# EAGLE design Harmonic Controller (EAGLE 9.6.2)
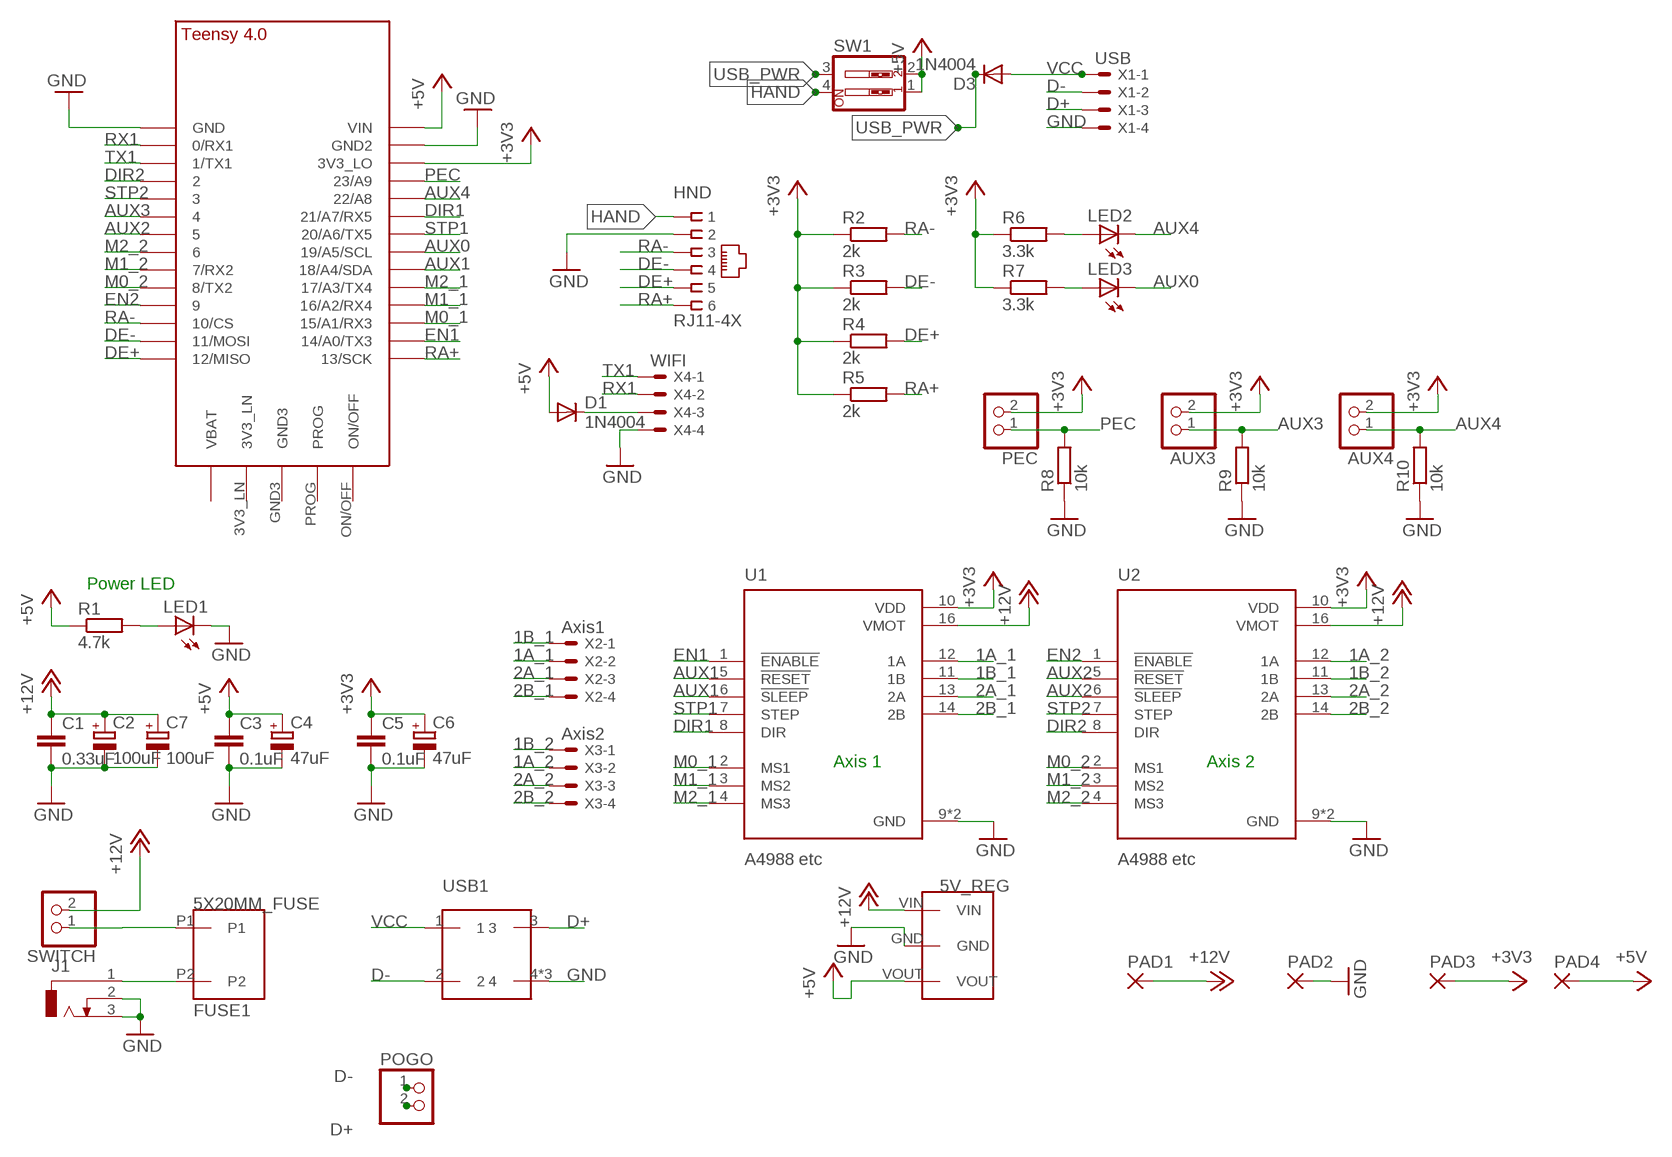
[diagram p0: schematic, sheet 1]

## Parts
5V_REG  TSR_5V  [TSR_5V]
AUX3  PINHD-1X2  [1X02]
AUX4  PINHD-1X2  [1X02]
C1  0.33uF  C-EU050-024X044  [C050-024X044]
C2  100uF  CPOL-EUE5-8.5  [E5-8,5]
C3  0.1uF  C-EU050-024X044  [C050-024X044]
C4  47uF  CPOL-EUE5-8.5  [E5-8,5]
C5  0.1uF  C-EU050-024X044  [C050-024X044]
C6  47uF  CPOL-EUE5-8.5  [E5-8,5]
C7  100uF  CPOL-EUE5-8.5  [E5-8,5]
D1  1N4004  [DO41-10]
D3  1N4004  [DO41-10]
FUSE1  5X20MM_FUSE  [5X20MM_FUSE]
HND  RJ11-4X  [RJ11-NO_SHIELD]
J1  DCJ0303  [DCJ0303]
LED1  LED5MM  [LED5MM]
LED2  LED5MM  [LED5MM]
LED3  LED5MM  [LED5MM]
PAD1  SMD2  [SMD1,27-2,54]
PAD2  SMD2  [SMD1,27-2,54]
PAD3  SMD2  [SMD1,27-2,54]
PAD4  SMD2  [SMD1,27-2,54]
PEC  PINHD-1X2  [1X02]
POGO  PINHD-1X2  [1X02]
R1  4.7k  R-EU_0207/7  [0207/7]
R2  2k  R-EU_0207/7  [0207/7]
R3  2k  R-EU_0207/7  [0207/7]
R4  2k  R-EU_0207/7  [0207/7]
R5  2k  R-EU_0207/7  [0207/7]
R6  3.3k  R-EU_0207/7  [0207/7]
R7  3.3k  R-EU_0207/7  [0207/7]
R8  10k  R-EU_0207/7  [0207/7]
R9  10k  R-EU_0207/7  [0207/7]
R10  10k  R-EU_0207/7  [0207/7]
SW1  SW_DIP-2  [EDG-02]
SWITCH  PINHD-1X2  [1X02]
U1  A4988 etc  A4988_STEPPER_MOTOR_DRIVER_CARRIER  [MODULE_A4988_STEPPER_MOTOR_DRIVER_CARRIER]
U2  A4988 etc  A4988_STEPPER_MOTOR_DRIVER_CARRIER  [MODULE_A4988_STEPPER_MOTOR_DRIVER_CARRIER]
U$1  TEENSY_4.0  [TEENSY_4.0]
USB1  USB-B_SOCKET  [USB-B_SOCKET]
X1  USB  JST-XH-04-PIN-ROUND-PAD  [JST-XH-04-PACKAGE-ROUND-PAD]
X2  Axis1  JST-XH-04-PIN-LONG-PAD  [JST-XH-04-PACKAGE-LONG-PAD]
X3  Axis2  JST-XH-04-PIN-LONG-PAD  [JST-XH-04-PACKAGE-LONG-PAD]
X4  WIFI  JST-XH-04-PIN-LONG-PAD  [JST-XH-04-PACKAGE-LONG-PAD]

## Nets
1A_1: U1.12(1A) X2.2
1A_2: U2.12(1A) X3.2
1B_1: U1.11(1B) X2.1
1B_2: U2.11(1B) X3.1
2A_1: U1.13(2A) X2.3
2A_2: U2.13(2A) X3.3
2B_1: U1.14(2B) X2.4
2B_2: U2.14(2B) X3.4
+3V3: AUX3.2 AUX4.2 C5.1 C6.+ PAD3.1(P) PEC.2 R2.1 R3.1 R4.1 R5.1 R6.1 R7.1 U1.10(VDD) U2.10(VDD) U$1.3V3_LO
+5V: 5V_REG.VOUT C3.1 C4.+ D1.A PAD4.1(P) R1.1 SW1.1 SW1.2 U$1.VIN
+12V: 5V_REG.VIN C1.1 C2.+ C7.+ PAD1.1(P) SWITCH.2 U1.16(VMOT) U2.16(VMOT)
AUX0: LED3.K(C) U$1.19/A5/SCL
AUX1: U1.5(!RESET) U1.6(!SLEEP) U$1.18/A4/SDA
AUX2: U2.5(!RESET) U2.6(!SLEEP) U$1.5
AUX3: AUX3.1 R9.2 U$1.4/CANRX
AUX4: AUX4.1 LED2.K(C) R10.2 U$1.22/A8
D+: POGO.2 USB1.3 X1.3
D-: POGO.1 USB1.2 X1.2
DE+: HND.5 R4.2 U$1.12/MISO
DE-: HND.4 R3.2 U$1.11/MOSI
DIR1: U1.8(DIR) U$1.21/A7(21/A7/RX5)
DIR2: U2.8(DIR) U$1.2
EN1: U1.1(!ENABLE) U$1.14/A0(14/A0/TX3)
EN2: U2.1(!ENABLE) U$1.9/CS
GND: 5V_REG.GND C1.2 C2.- C3.2 C4.- C5.2 C6.- C7.- HND.2 J1.2 J1.3 LED1.K(C) PAD2.1(P) R8.1 R9.1 R10.1 U1.9(GND) U1.15(GND) U2.9(GND) U2.15(GND) U$1.GND U$1.GND2 USB1.4 USB1.P$1 USB1.P$2 X1.4 X4.4
HAND: HND.1 SW1.4
M0_1: U1.2(MS1) U$1.15/A1(15/A1/RX3)
M0_2: U2.2(MS1) U$1.8(8/TX2)
M1_1: U1.3(MS2) U$1.16/A2(16/A2/RX4)
M1_2: U2.3(MS2) U$1.7(7/RX2)
M2_1: U1.4(MS3) U$1.17/A3(17/A3/TX4)
M2_2: U2.4(MS3) U$1.6
N$1: FUSE1.P2 J1.1
N$2: FUSE1.P1 SWITCH.1
N$3: LED1.A R1.2
N$4: D1.C X4.3
N$7: LED2.A R6.2
N$8: LED3.A R7.2
PEC: PEC.1 R8.2 U$1.23/A9
RA+: HND.6 R5.2 U$1.13/SCK
RA-: HND.3 R2.2 U$1.10/CS
RX1: U$1.0/RX(0/RX1) X4.2
STP1: U1.7(STEP) U$1.20/A6(20/A6/TX5)
STP2: U2.7(STEP) U$1.3/CANTX
TX1: U$1.1/TX(1/TX1) X4.1
USB_PWR: D3.C SW1.3
VCC: D3.A USB1.1 X1.1
Unconnected: U$1.3V3_LN U$1.GND3 U$1.ON/OFF U$1.PROG U$1.VBAT\(VBAT)

## Notes on the sheet
- Power LED
- Axis 1 | Axis 2

## Library data of the parts
5V_REG = alans_lbr:TSR_5V
AUX3 AUX4 PEC POGO SWITCH = pinhead:PINHD-1X2: PIN HEADER
C1 C3 C5 = rcl:C-EU: CAPACITOR, European symbol; SPICEPREFIX: C
C2 C4 C6 C7 = rcl:CPOL-EU: POLARIZED CAPACITOR, European symbol; SPICEPREFIX: C
D1 D3 = adafruit:1N4004: DIODE General purpose 1N400x type rectifier (With bigger pads) http://www.ladyada.net/library/pcb/eaglelibrary.html
FUSE1 = alans_lbr:5X20MM_FUSE
HND = con-tycoelectronics:RJ11: CORCOM Modular RJ Jacks No Shield Source: www.tycoelectronics.com .. ENG_DS_1654001_1099_RJ_L_0507.pdf; MPN: 6609214-3; OC_FARNELL: unknown; OC_NEWARK: 19R7022
J1 = con-jack:DCJ0303: DC POWER JACK Source: DCJ0303.pdf; OC_FARNELL: unknown; OC_NEWARK: unknown
LED1-LED3 = adafruit:LED: LED OSRAM: - CHIPLED LG R971, LG N971, LY N971, LG Q971, LY Q971, LO R971, LY R971 LH N974, LH R974 LS Q976, LO Q976, LY Q976 LO Q996 - Hyper CHIPLED LW Q18S LB Q993, LB Q99A, LB R99A - SideLED LS A670, LO A670, LY A670, LG A670, LP A670 LB A673, LV A673, LT A673, LW A673 LH A674 LY A675 LS A676, LA A676, LO A676, LY A676, LW A676 LS A679, LY A679, LG A679 - Hyper Micro SIDELED® LS Y876, LA Y876, LO Y876, LY Y876 LT Y87S - SmartLED LW L88C, LW L88S LB L89C, LB L89S, LG L890 LS L89K, LO L89K, LY L89K LS L896, LA L896, LO L896, LY L896 - TOPLED LS T670, LO T670, LY T670, LG T670, LP T670 LSG T670, LSP T670, LSY T670, LOP T670, LYG T670 LG T671, LOG T671, LSG T671 LB T673, LV T673, LT T673, LW T673 LH T674 LS T676, LA T676, LO T676, LY T676, LB T676, LH T676, LSB T676, LW T676 LB T67C, LV T67C, LT T67C, LS T67K, LO T67K, LY T67K, LW E67C LS E67B, LA E67B, LO E67B, LY E67B, LB E67C, LV E67C, LT E67C LW T67C LS T679, LY T679, LG T679 LS T770, LO T770, LY T770, LG T770, LP T770 LB T773, LV T773, LT T773, LW T773 LH T774 LS E675, LA E675, LY E675, LS T675 LS T776, LA T776, LO T776, LY T776, LB T776 LHGB T686 LT T68C, LB T68C - Hyper Mini TOPLED® LB M676 - Mini TOPLED Santana® LG M470 LS M47K, LO M47K, LY M47K Source: http://www.osram.convergy.de/
PAD1-PAD4 = wirepad:SMD2: SMD PAD
R1-R10 = rcl:R-EU_: RESISTOR, European symbol; SPICEPREFIX: R
SW1 = special:SW_DIP-2: DIP SWITCH
U1 U2 = A4988_STEPPER_MOTOR_DRIVER_CARRIER:A4988_STEPPER_MOTOR_DRIVER_CARRIER: Stepper motor controler; IC: A4988; 1A; Uin mot: 8÷35V Check availability <https://pricing.snapeda.com/parts/A4988%20STEPPER%20MOTOR%20DRIVER%20CARRIER/Pololu/view-part?ref=eda>; AVAILABILITY: Not in stock; DESCRIPTION: Stepper Motor Driver; MF: Pololu; MP: A4988 STEPPER MOTOR DRIVER CARRIER; PACKAGE: None; PRICE: None
U$1 = TEENSY 4.0:TEENSY_4.0
USB1 = alans_lbr:USB-B_SOCKET
X1-X4 = JST_XH_Connectors:JST-XH-04-PIN: JST XH Connector 2 Pin Wire to board connector. Pitch: 2,54 mm, (0.100") Number of pins: 4 Created by Rembrandt Electronics www.rembrandtelectronics.com

## Board
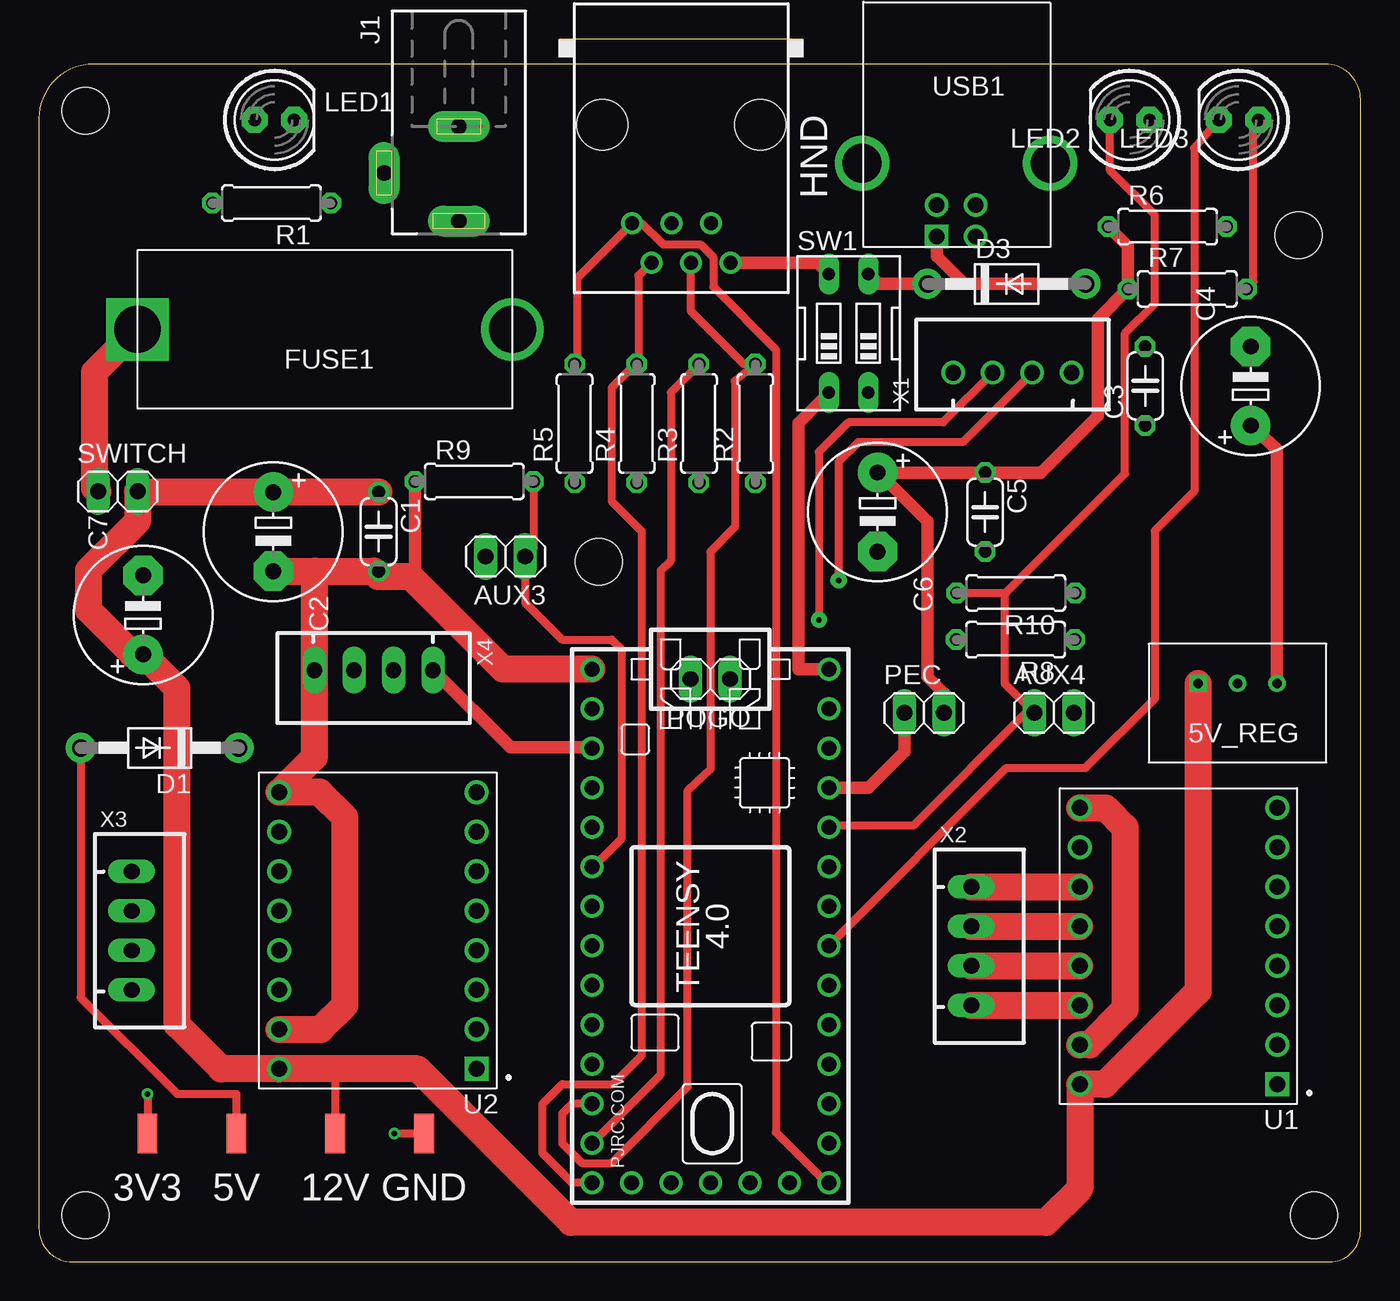
[diagram p1: board, top side]
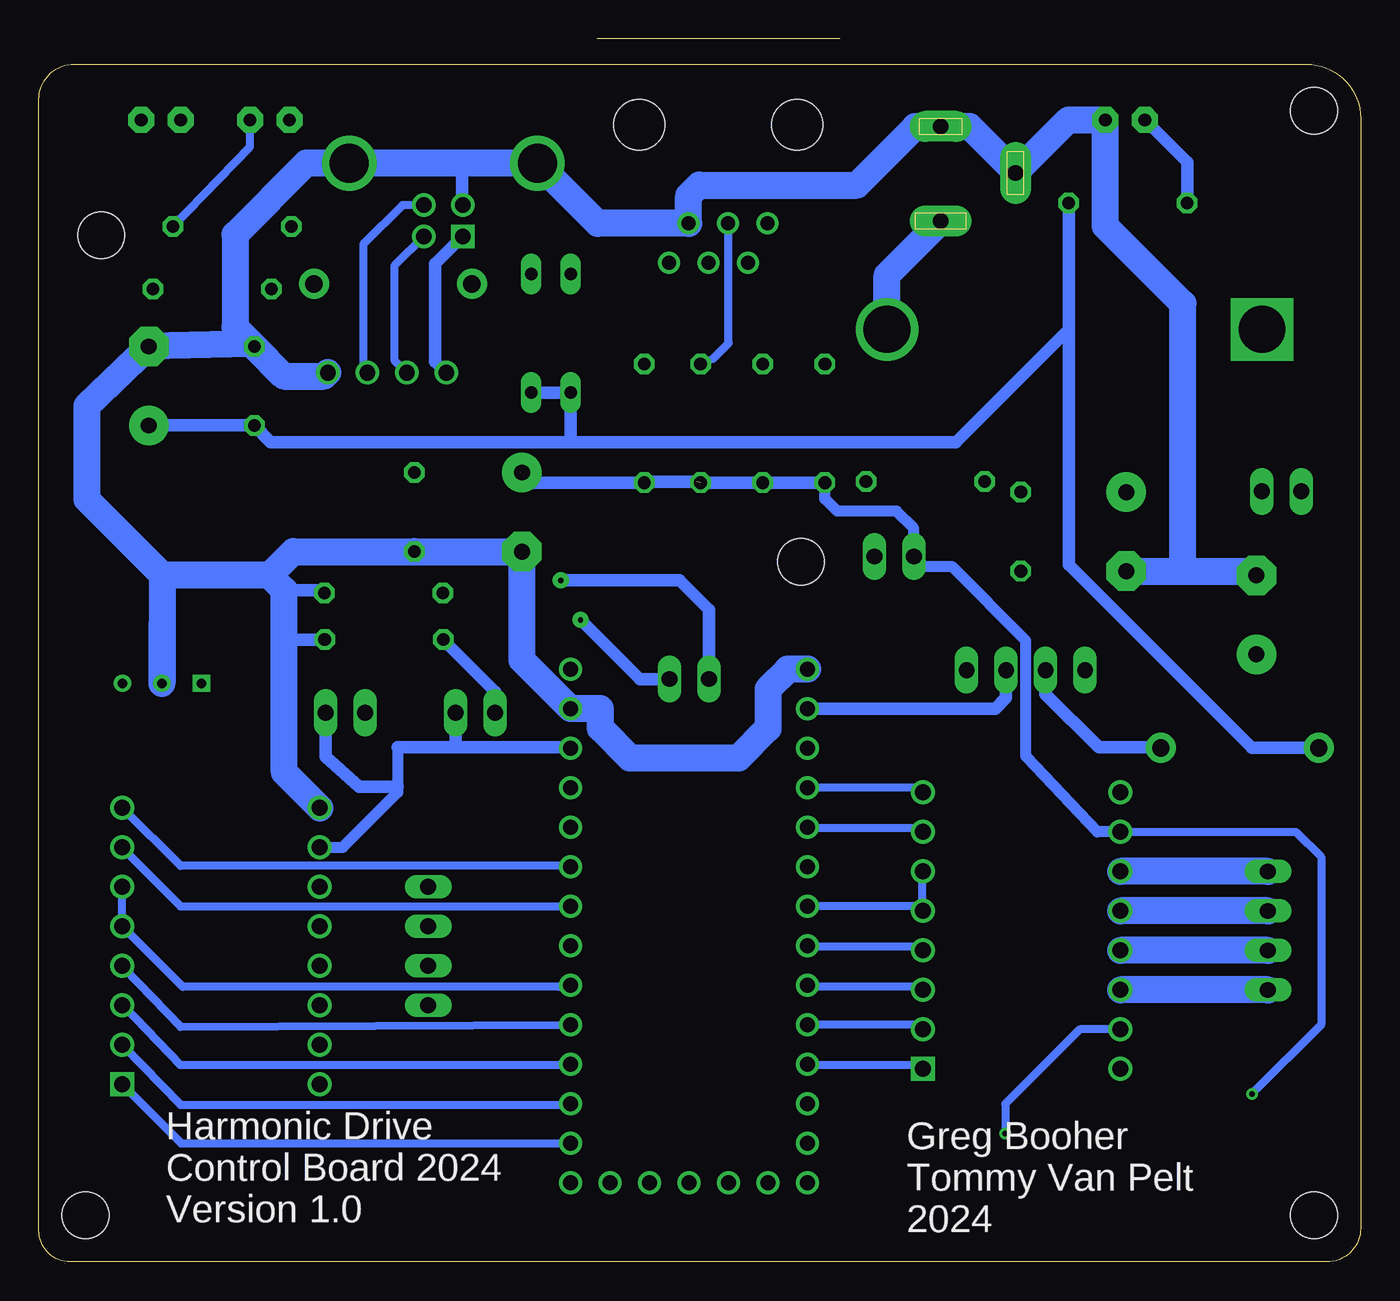
[diagram p2: board, bottom side, seen from below]

Size 85 x 77 mm. Coordinates in mm from the lower left corner, seen from the top.
Outline: 0,73.5 0,2.17 arc90 2.17,0 82.99,0 arc90 85,2.01 85,74.72 arc90 82.72,77 3.5,77 arc90 0,73.5
Copper layers (1*16): Top 0.035mm / dielectric 1.5mm / Bottom 0.035mm
Design rules "default": minimum track width 6mil, minimum drill 0.35mm, track to track 6mil, track to pad 6mil, pad to pad 6mil, via to via 6mil, smd to smd 6mil, copper to edge 40mil, drill to drill 6mil, minimum pad ring 10mil, minimum via ring 8mil, stop-mask expansion 4mil, vias tented up to drill 0mil, thermal gap 10mil
Holes 3 mm at 3,74 3,3 82,3 81,66 36,45

### Footprints (pad centres in the part's own frame; a part is rotated, then mirrored left to right if it is on the bottom)
TSR_5V = drill 0.6: GND 5.715,5.08; VOUT 8.255,5.08 | drill 0.6 square: VIN 3.175,5.08
1X02 = drill 1.016 long: 1 -1.27,0; 2 1.27,0
C050-024X044 = drill 0.813 octagon: 1 -2.54,0; 2 2.54,0
E5-8,5 = drill 1.016 pad 2.54: + -2.54,0 | drill 1.016 pad 2.54 octagon: - 2.54,0
DO41-10 = drill 1.118 pad 1.93: A 5.08,0; C -5.08,0
5X20MM_FUSE = drill 3 square: P1 5.08,24.13 | drill 3: P2 5.08,0
RJ11-NO_SHIELD = drill 0.9 pad 1.4: 1 -3.175,8.89; 2 -1.905,6.35; 3 -0.635,8.89; 4 0.635,6.35; 5 1.905,8.89; 6 3.175,6.35 | hole 3.251: -5.08,0; 5.08,0
DCJ0303 = drill 1 pad 2 long: 1 0,3.1; 2 4.8,0; 3 0,-3
LED5MM = drill 0.813 pad 1.676 octagon: A -1.27,0; K 1.27,0
SMD1,27-2,54 = smd 1.27 x 2.54: 1 0,0
0207/7 = drill 0.813 octagon: 1 -3.81,0; 2 3.81,0
EDG-02 = drill 0.813 long: 1 -1.27,-3.81; 2 1.27,-3.81; 3 1.27,3.81; 4 -1.27,3.81
MODULE_A4988_STEPPER_MOTOR_DRIVER_CARRIER = drill 1.02 square: 1 -6.35,8.89 | drill 1.02: 2 -6.35,6.35; 3 -6.35,3.81; 4 -6.35,1.27; 5 -6.35,-1.27; 6 -6.35,-3.81; 7 -6.35,-6.35; 8 -6.35,-8.89; 9 6.35,-8.89; 10 6.35,-6.35; 11 6.35,-3.81; 12 6.35,-1.27; 13 6.35,1.27; 14 6.35,3.81; 15 6.35,6.35; 16 6.35,8.89
TEENSY_4.0 = drill 0.965: 0/RX -13.97,-7.62; 1/TX -11.43,-7.62; 2 -8.89,-7.62; 3/CANTX -6.35,-7.62; 3V3_LN 16.51,-2.54; 3V3_LO -11.43,7.62; 4/CANRX -3.81,-7.62; 5 -1.27,-7.62; 6 1.27,-7.62; 7 3.81,-7.62; 8 6.35,-7.62; 9/CS 8.89,-7.62; 10/CS 11.43,-7.62; 11/MOSI 13.97,-7.62; 12/MISO 16.51,-7.62; 13/SCK 16.51,7.62; 14/A0 13.97,7.62; 15/A1 11.43,7.62; 16/A2 8.89,7.62; 17/A3 6.35,7.62; 18/A4/SDA 3.81,7.62; 19/A5/SCL 1.27,7.62; 20/A6 -1.27,7.62; 21/A7 -3.81,7.62; 22/A8 -6.35,7.62; 23/A9 -8.89,7.62; GND -16.51,-7.62; GND2 -13.97,7.62; GND3 16.51,0; ON/OFF 16.51,5.08; PROG 16.51,2.54; VBAT\ 16.51,-5.08; VIN -16.51,7.62
USB-B_SOCKET = drill 1 square: 1 7.3,4.7 | drill 1: 2 4.8,4.7; 3 4.8,2.7; 4 7.3,2.7 | drill 2.5: P$1 0,0; P$2 12.1,0
JST-XH-04-PACKAGE-ROUND-PAD = drill 1.016: 1 -3.81,0; 2 -1.27,0; 3 1.27,0; 4 3.81,0
JST-XH-04-PACKAGE-LONG-PAD = drill 1.016 long: 1 -3.81,0; 2 -1.27,0; 3 1.27,0; 4 3.81,0

### Placement (x,y rotation side)
5V_REG  71.36,32.11 0 top
AUX3  30,45.34 180 top
AUX4  65.28,35.3 0 top
C1  21.85,46.94 270 top
C2  15.07,46.94 270 top
C3  71.15,56.31 90 top
C4  77.93,56.31 90 top
C5  60.85,48.2 270 top
C6  53.93,48.2 270 top
C7  6.71,41.59 90 top
D1  7.77,33.04 180 top
D3  62.23,62.87 0 top
FUSE1  30.46,54.87 90 top
HND  41.31,73.11 180 top
J1  27,70 180 top
LED1  15.15,73.41 0 top
LED2  70.15,73.41 180 top
LED3  77.15,73.41 180 top
PAD1  19.05,8.26 0 top
PAD2  24.77,8.26 0 top
PAD3  6.99,8.26 0 top
PAD4  12.7,8.26 0 top
PEC  56.93,35.3 0 top
POGO  43.18,37.47 180 top
R1  14.96,68.07 180 top
R2  46.07,53.9 90 top
R3  42.45,53.9 90 top
R4  38.45,53.9 90 top
R5  34.45,53.9 90 top
R6  72.58,66.55 0 top
R7  73.85,62.55 0 top
R8  62.81,40 180 top
R9  28,50.17 0 top
R10  62.83,43 180 top
SW1  52.07,59.69 0 top
SWITCH  5.08,49.53 0 top
U1  73.29,20.3 180 top
U2  21.8,21.3 180 top
U$1  43.18,21.59 270 top
USB1  65.04,70.63 180 top
X1  62.61,57.16 0 top
X2  59.96,20.3 270 top
X3  5.96,21.29 270 top
X4  21.53,38.04 180 top

### Tracks (layer width: path | path; a pad name or v marks a point on that pad's centre or on a via)
1A_1
  Top 1.75: X2.2 60.21,21.57 U1.12
1A_2
  Bottom 1.75: X3.2 U2.12
1B_1
  Top 1.75: X2.1 60.21,24.11 U1.11
1B_2
  Bottom 1.75: X3.1 U2.11
2A_1
  Top 1.75: X2.3 60.21,19.03 U1.13
2A_2
  Bottom 1.75: X3.3 U2.13
2B_1
  Top 1.75: X2.4 60.21,16.49 U1.14
2B_2
  Bottom 1.75: X3.4 U2.14
+3V3  (via drill 0.35)  (2 unrouted)
  Top 0.508: v6.99,10.79 PAD3.1
  Top 0.813: R6.1 70.04,65.28 R7.1 68.1,60.61 68.1,54.41 64.43,50.74 C5.1 C6.+ | PEC.2 58.2,36.56 57.15,37.62 57.15,47.62 54.03,50.74
  Bottom 0.152: 46.02,50.14 R2.1 46.18,49.99 | 34.44,49.99 R5.1 | 50.9,33.07 U$1.3V3_LO
  Bottom 0.508: U2.10 4.16,27.65 2.54,26.04 2.54,15.24 v6.99,10.79
  Bottom 0.7: U2.10 16.93,27.65 21.53,32.51 21.53,39.95 26.29,44.7 28.1,44.7 AUX3.2 28.73,47.15 29.84,48.26 33.66,48.26 34.45,49.05 R5.1 | U1.10 65.45,26.65 61.92,30.18 61.92,30.53 61.92,33.07
  Bottom 0.813: 42.67,50.14 46.02,50.14 | 58.2,33.07 50.9,33.07 | AUX4.2 66.55,32.47 64.4,30.53 61.92,30.53 | PEC.2 58.2,33.07 | 58.2,33.07 61.92,33.07 | R3.1 R4.1 R5.1 | R2.1 53.28,50.09 C6.+ 54.03,50.74
+5V
  Top 0.508: D1.A 2.69,17 8.89,10.79 12.7,10.79 PAD4.1
  Top 0.813: U$1.VIN 48.84,38.1 48.84,53.92 SW1.1 | 5V_REG.VOUT 79.62,52.24 C4.+
  Bottom 0.813: 50.8,52.7 70.08,52.7 C3.1 C4.+ | 18.77,59.97 26.04,52.7 50.8,52.7 | 18.77,59.97 R1.1 | D1.A 7,33.04 18.77,44.8 18.77,59.97 | 50.8,52.7 SW1.1 SW1.2
+12V
  Top 0.508: 19.05,12.41 PAD1.1
  Top 1.75: C1.1 C2.+ 6.4,49.48 SWITCH.2 6.35,47.62 3.17,44.45 3.17,41.91 6.03,39.05 C7.+ 8.89,36.87 8.89,15.24 11.72,12.41 U2.16 19.05,12.41 24.34,12.41 34.21,2.54 64.77,2.54 66.94,4.71 U1.16 68.56,11.41 74.54,17.39 5V_REG.VIN
AUX0
  Top 0.5: U$1.19/A5/SCL 62.23,31.75 67.31,31.75 71.75,36.2 71.75,46.99 73.03,48.26 74.3,49.53 74.3,71.6 LED3.K
AUX1
  Bottom 0.508: U1.6 U1.5 75.75,17.68 51.54,17.68 51.44,17.78 U$1.18/A4/SDA
AUX2
  Bottom 0.508: U$1.5 28.35,22.86 28.19,22.71 | 28.19,22.71 28.19,24.99 U2.6 | 28.19,22.71 U2.5
AUX3
  Top 0.508: U$1.4/CANRX 35.66,25.4 37.47,27.2 37.47,39.37 36.83,40.01 33.66,40.01 31.27,42.38 AUX3.1 31.81,45.88 R9.2
AUX4
  Top 0.152: 50.9,28.04 U$1.22/A8 | 59.16,43.13 R10.2
  Top 0.5: 50.9,28.04 56.24,28.04 63.48,35.29 AUX4.1 62.1,37.2 62.1,43 R10.2 62.19,43 69.85,50.66 69.85,59.69 71.75,61.59 71.75,67.31 68.88,70.19 LED2.K
D+  (via drill 0.35 pad 1.05)
  Top 0.5: X1.3 59.42,52.7 52.7,52.7 51.44,51.44 v51.44,43.81
  Bottom 0.5: USB1.3 61.61,67.93 64.14,65.41 64.14,57.42 X1.3
  Bottom 0.813: v51.44,43.81 43.81,43.81 41.91,41.91 POGO.2
D-  (via drill 0.35 pad 1.05)
  Top 0.5: X1.2 58.15,53.98 52.07,53.98 50.16,52.07 v50.16,41.27
  Bottom 0.5: USB1.2 62.15,64.03 62.15,57.97 X1.2
  Bottom 0.813: v50.16,41.27 46.35,37.47 POGO.1
DE+
  Top 0.152: 38.56,57.91 R4.2 38.41,57.76 | 39.32,64.16 HND.5
  Top 0.508: 38.56,57.91 38.56,63.4 39.32,64.16 | 38.41,57.76 36.83,56.19 36.83,48.9 38.79,46.94 38.79,13.28 36.93,11.43 33.66,11.43 32.38,10.16 32.38,6.99 34.29,5.08 U$1.12/MISO
DE-
  Top 0.508: R3.2 40.64,55.9 40.64,45.09 40.01,44.45 40.01,12.06 U$1.11/MOSI
  Bottom 0.152: 40.69,66.75 HND.4
  Bottom 0.508: HND.4 40.67,59.09 40.64,59.05 41.66,58.03 R3.2
DIR1
  Bottom 0.152: 79.55,29.11 U1.8
  Bottom 0.508: 79.55,29.11 75.89,25.45 50.85,25.45 U$1.21/A7
DIR2
  Bottom 0.508: U$1.2 28.35,30.48 28.19,30.33 U2.8
EN1
  Bottom 0.508: U$1.14/A0 75.56,7.62 75.85,7.62 U1.1
EN2
  Bottom 0.508: U$1.9/CS 35.51,12.65 28.35,12.65 28.19,12.5 U2.1
GND  (via drill 0.35)
  Top 0.152: 21.86,44.09 C1.2 21.79,44.04
  Top 0.508: v22.86,8.26 PAD2.1
  Top 0.813: 21.55,44.4 21.86,44.09 | 17.72,44.34 17.78,44.4 | R9.1 24.19,44.33 23.9,44.04
  Top 1.75: U1.9 68.6,29.19 69.85,27.94 69.85,16.23 67.58,13.95 U1.15 | U2.15 18.12,14.95 19.68,16.51 19.68,28.57 18.07,30.19 U2.9 17.72,32.46 X4.4 17.72,44.34 | C2.- 17.78,44.4 21.55,44.4 | U$1.GND 29.84,38.1 23.9,44.04 21.79,44.04
  Bottom 0.152: 22.1,70.1 J1.2 22.25,70.1
  Bottom 0.508: U2.15 18.07,14.95 22.86,10.16 v22.86,8.26
  Bottom 0.813: USB1.4 57.78,67.97 57.78,70.63
  Bottom 0.818: R8.1 69.22,40.01 | R10.1 66.81,43.18 69.22,43.18
  Bottom 1.75: 22.25,70.1 25.15,73 J1.3 | 27.13,73 28.65,73 28.65,72.95 32.38,69.22 42.55,69.22 43.22,68.55 HND.2 49.07,66.76 USB1.P$2 57.78,70.63 USB1.P$1 67.8,70.63 72.39,66.04 72.39,60.09 C3.2 | C3.2 69.25,56.95 66.64,56.95 X1.4 | C3.2 71.31,59.01 C4.- 81.92,55.02 81.92,49.01 77.08,44.17 | 77.08,44.17 5V_REG.GND 77.08,41 | 53.93,45.04 53.93,38.69 U$1.GND2 48.9,35.56 48.9,34.29 46.99,32.38 40.01,32.38 38.1,34.29 38.1,36.83 36.83,38.1 U$1.GND | 53.93,45.04 54.55,45.66 C5.2 68.64,45.66 70.12,44.17 70.21,44.17 | J1.2 18.79,73.41 LED1.K 16.42,66.58 11.43,61.59 11.43,44.4 C2.- 6.97,44.4 C7.- | 70.21,44.17 69.22,43.18 69.22,40.01 69.22,31.46 U1.9 | 77.08,44.17 70.21,44.17 | C6.- 53.93,45.04 | J1.3
  other vias: 60.85,45.66
HAND
  Top 0.813: HND.1 50.08,64.22 SW1.4
M0_1
  Bottom 0.152: 79.55,13.87 U1.2
  Bottom 0.508: 79.55,13.87 75.89,10.1 50.86,10.1 U$1.15/A1
M0_2
  Bottom 0.508: U$1.8 28.35,15.24 28.19,15.09 U2.2
M1_1
  Bottom 0.152: 79.55,16.46 U1.3
  Bottom 0.508: 79.55,16.46 75.89,12.65 51.56,12.65 51.51,12.7 U$1.16/A2
M1_2
  Bottom 0.508: U$1.7 35.51,17.68 28.35,17.68 28.19,17.53 U2.3
M2_1
  Bottom 0.152: 79.55,18.9 U1.4
  Bottom 0.508: U$1.17/A3 75.89,15.1 79.55,18.9
M2_2
  Bottom 0.508: U$1.6 35.51,20.27 28.35,20.27 28.19,20.12 U2.4
N$1
  Bottom 1.75: FUSE1.P2 30.46,63.44 J1.1
N$2
  Top 1.75: FUSE1.P1 3.59,57.21 3.59,49.75 SWITCH.1
N$3
  Bottom 0.813: R1.2 11.15,70.68 LED1.A
N$4
  Bottom 0.813: X4.3 20.26,36.49 16.84,33.07 12.95,33.07 D1.C
N$7
  Bottom 0.5: R6.2 71.42,71.68 LED2.A
N$8
  Top 0.5: R7.2 78.11,62.99 78.11,73.09 LED3.A
PEC
  Top 0.813: U$1.23/A9 53.34,30.48 55.66,32.8 PEC.1
  Bottom 0.813: PEC.1 55.66,36.66 R8.2
RA+
  Top 0.152: 34.59,57.76 R5.2 | 38.1,66.75 HND.6
  Top 0.508: 34.59,57.76 34.59,63.25 38.1,66.75 | U$1.13/SCK 50.65,5.08 47.4,8.33 47.4,58.65 43.38,62.67 43.38,64.58 42.55,65.41 40.14,65.41 38.77,66.76 HND.6
RA-
  Top 0.508: HND.3 41.95,61.1 45.34,57.71 R2.2 44.75,56.64 44.75,47.25 43.18,45.63 43.18,31.66 41.73,30.3 41.73,11.25 36.83,6.35 34.92,6.35 33.66,7.62 33.66,9.53 34.29,10.16 U$1.10/CS
RX1
  Bottom 0.813: X4.2 22.8,36.26 23.5,35.56 U$1.0/RX
STP1
  Bottom 0.152: 79.55,26.52 U1.7
  Bottom 0.508: U$1.20/A6 75.89,22.86 79.55,26.52
STP2
  Bottom 0.508: U$1.3/CANTX 35.51,27.89 28.35,27.89 28.19,27.74 U2.7
TX1
  Top 0.152: 35.51,33.07 U$1.1/TX | 25.45,37.95 X4.1
  Top 0.813: 35.51,33.07 30.33,33.07 25.45,37.95
USB_PWR
  Top 0.813: D3.C 53.98,62.87 SW1.3
VCC
  Top 0.813: D3.A 59.53,62.87 57.74,64.66 USB1.1
  Bottom 0.813: USB1.1 59.51,64.16 59.51,57.88 X1.1

### Text on the board
tNames: 3V3 | 5V | 12V | GND
bNames: Harmonic Drive / Control Board 2024 / Version 1.0 | Greg Booher / Tommy Van Pelt / 2024